# Altium schematic sheet can_phy.SchDoc
size A4
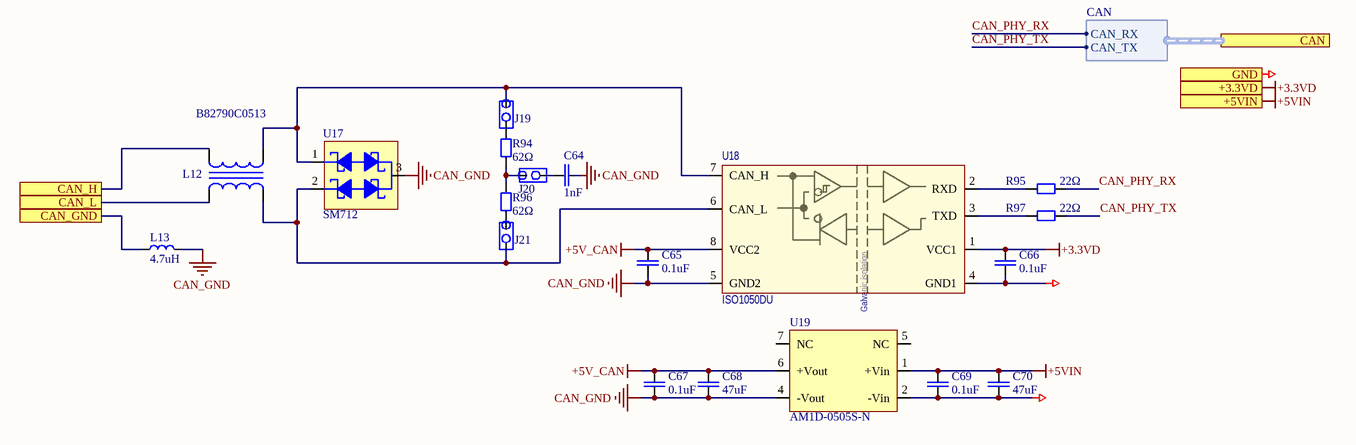
[diagram p0: can_phy.SchDoc]

## Parts
C64  value 1nF  [CAPC3216N]  (hidden comment: 1nF; 2kV)
C65  0.1uF  [CAPC2012N]
C66  0.1uF  [CAPC2012N]
C67  0.1uF  [CAPC2012N]
C68  47uF  [CAPC3216N]
C69  0.1uF  [CAPC2012N]
C70  47uF  [CAPC3216N]
J19  PLS-2  [PLS-2]  (value not drawn)
J20  PLS-2  [PLS-2]  (value not drawn)
J21  PLS-2  [PLS-2]  (value not drawn)
L12  B82790C0513  [SMD_B82790]
L13  value 4.7uH  [IND_3225_MURATA_LQH_N]  (hidden comment: LQH32PN4R7NN0L)
R94  62Ω  [RESC2012N]
R95  22Ω  [RESC1608N]
R96  62Ω  [RESC2012N]
R97  22Ω  [RESC1608N]
U17  SM712  [SOT95P240X110-3N]
U18  ISO1050DU  [SOP8]
U19  AM1D-0505S-N  [SIP-7]

## Ports
+3.3VD, +5VIN, CAN (harness CAN), CAN_GND, CAN_H, CAN_L, GND

## Harnesses
CAN: CAN_TX, CAN_RX

## Nets
+3.3VD: C66.2 U18.1(VCC1) ; port +3.3VD
+5V_CAN: C65.2 C67.2 C68.2 U18.8(VCC2) U19.6(+Vout)
+5VIN: C69.2 C70.2 U19.1(+Vin) ; port +5VIN
CAN_GND: C64.1 C65.1 C67.1 C68.1 L13.2 U17.3 U18.5(GND2) U19.4(-Vout)
GND: C66.1 C69.1 C70.1 U18.4(GND1) U19.2(-Vin) ; port GND
CAN_GND: L13.1 ; port CAN_GND  [a separate net that carries the same name]
CAN_H: L12.1 ; port CAN_H
CAN_L: L12.4 ; port CAN_L
CAN_PHY_RX: R95.2 ; port CAN.CAN_RX
CAN_PHY_TX: R97.2 ; port CAN.CAN_TX
NetC64_2: C64.2 J20.2
NetJ19_1: J19.1 L12.2 U17.1 U18.7(CAN_H)
NetJ19_2: J19.2 R94.2
NetJ20_1: J20.1 R94.1 R96.2
NetJ21_1: J21.1 R96.1
NetJ21_2: J21.2 L12.3 U17.2 U18.6(CAN_L)
NetR95_1: R95.1 U18.2(RXD)
NetR97_1: R97.1 U18.3(TXD)

Not connected (* = marked no-connect by the designer): U19 5(NC) 7(NC)

## Notes on the sheet
- (in symbol ISO1050DU) Galvanic isolation

## Library data of the parts
C64 = CAPC: Generic ceramic SMD capacitor; Pkg: 1206; Maintainer: Evgeniy Kotov; SMD Solders: 2; THD Solders: 0; PartField: 1nF; Last Change Data: 06.03.2017; Release Date: 06.03.2017; VoltageRating: 2kV
C65-C67 C69 = CAPC: Generic ceramic SMD capacitor; Pkg: 0805; Maintainer: Evgeniy Kotov; SMD Solders: 2; THD Solders: 0; PartField: 0.1uF; Last Change Data: 06.03.2017; Release Date: 06.03.2017; Value: 0.1uF
C68 C70 = CAPC: Generic ceramic SMD capacitor; Pkg: 1006; Maintainer: Evgeniy Kotov; SMD Solders: 2; THD Solders: 0; PartField: 47uF; Last Change Data: 06.03.2017; Release Date: 06.03.2017; Value: 47uF
J19-J21 = PLS-2: Connector, 5x2, Male, 2.54mm Pitch, Right Angle; SMD Solders: 0; THD Solders: 2; Maintainer: Evgeniy Kotov; PartField: PLS-2; Last Change Data: 02.04.2017; Release Date: 02.04.2017; Value: PLS-2; ComponentLink1Description: Datasheet; Pkg: PLS-2
L12 = B82790C0513: Pkg: SMD 4 pin; SMD Solders: 4; THD Solders: 0; Vendor: Epcos; PartField: B82790C0513; Value: B82790C0513
L13 = LQH32PN4R7NN0L: Inductor, Fixed, 1210, 4.7uH, 216mOhm, 1A, 30%; Pkg: 1210; Vendor: Murata; Maintainer: Evgeniy Kotov; SMD Solders: 2; THD Solders: 0; DC Current: 750mA; Tolerance: 20%; DC Resistance: 380mΩ; PartField: LQH32PN4R7NN0L; Release Date: 30.03.2017; Last Change Data: 30.03.2017; Temperature Range: -40°C to +105°C
R94 R96 = RESC: Resistor, Generic, SMD; Pkg: 0805; Maintainer: Evgeniy Kotov; SMD Solders: 2; THD Solders: 0; PartField: 62Ω; Release Date: 06.03.2017; Last Change Data: 09.03.2017; Value: 62Ω
R95 R97 = RESC: Resistor, Generic, SMD; Pkg: 0603; Maintainer: Evgeniy Kotov; SMD Solders: 2; THD Solders: 0; PartField: 22Ω; Release Date: 06.03.2017; Last Change Data: 09.03.2017; Value: 22Ω
U17 = SM712: Pkg: SOT23-3; SMD Solders: 3; THD Solders: 0; Vendor: SemTech; ComponentLink1Description: Datasheet; ComponentLink1URL: https://static.chipdip.ru/lib/081/DOC001081416.pdf; Last Change Data: 05.03.2020; PartField: SM712; Value: SM712
U18 = ISO1050DU: Order: main; Pkg: SOP-8; SMD Solders: 8; THD Solders: 0; PartField: ISO1050DU; Value: ISO1050DU
U19 = AM1D-0505S-N: AM3G-0505DZ; Manufactuer: Aimtec; SolderOption: 0; Pkg: SIP-7pin; THD Solders: 7; HelpURL: http://www.aimtec.com/site/Aimtec/files/Datasheet/HighResolution/AM1D-NZ.pdf; Manufacturer: Aimtec; PartField: AM1D-0505S-N; Value: AM1D-0505S-N; Vendor: Aimtec; SMD Solders: 0